# EAGLE design Encoder (EAGLE 6.2)
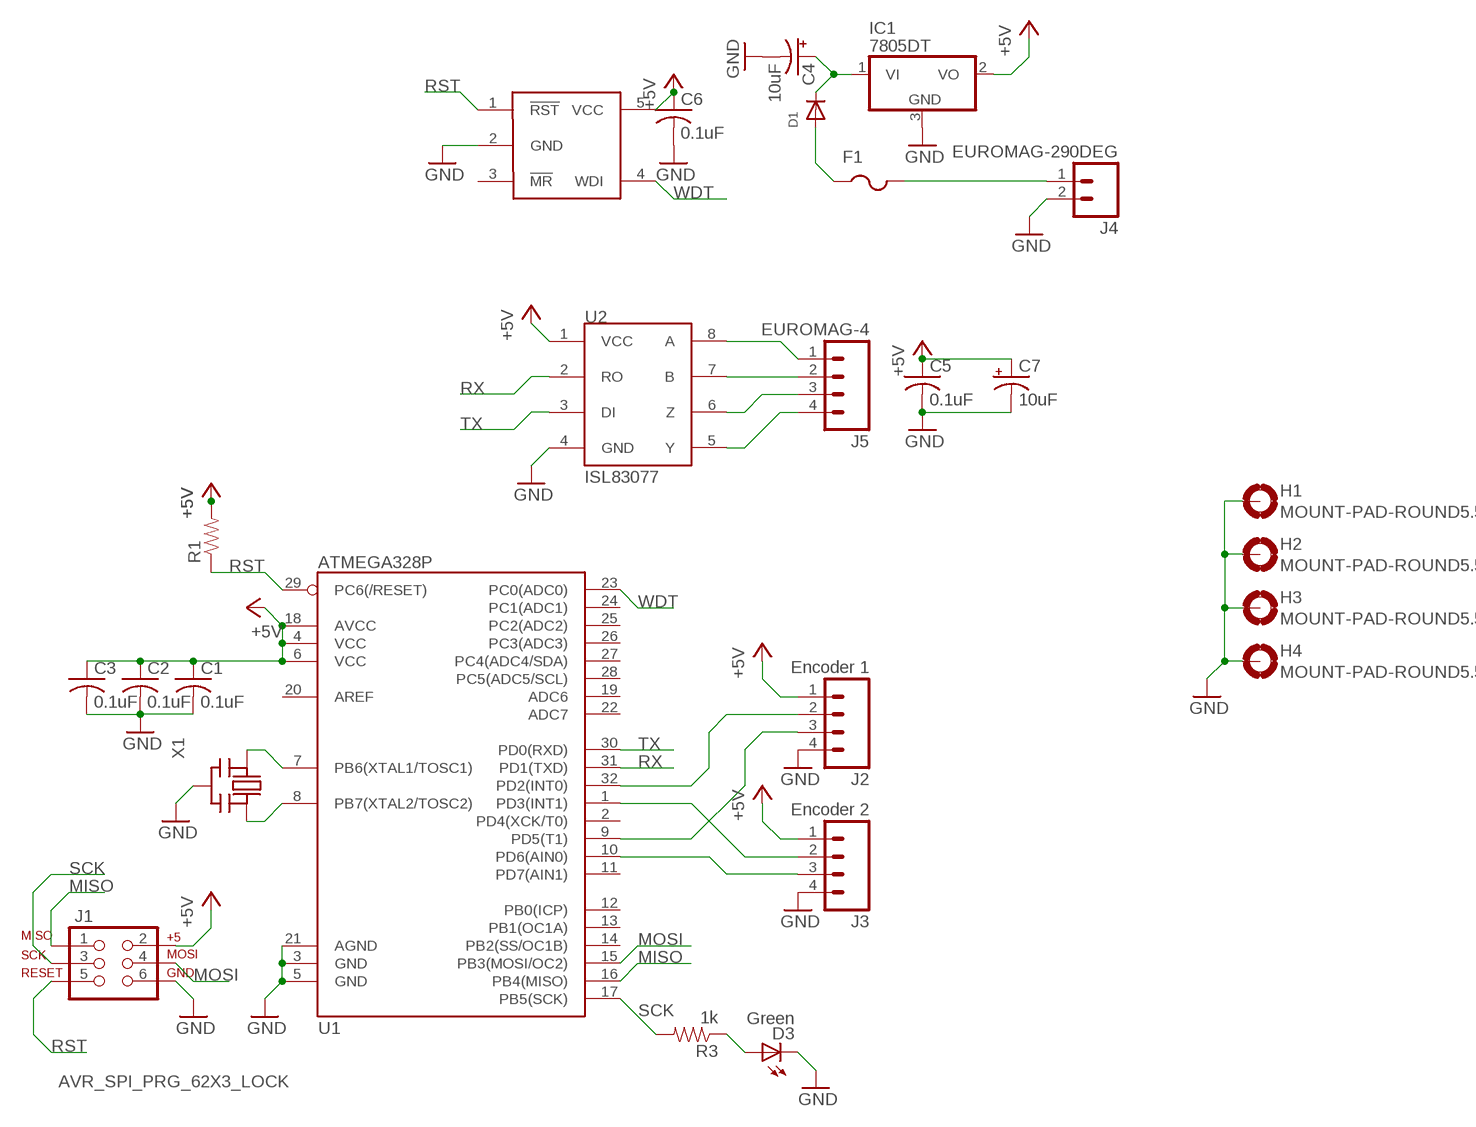
[diagram p0: schematic, sheet 1]

## Parts
C1  0.1uF  C-USC0805  [C0805]
C2  0.1uF  C-USC0805  [C0805]
C3  0.1uF  C-USC0805  [C0805]
C4  10uF  CPOL-USCT6032  [CT6032]
C5  0.1uF  C-USC0805  [C0805]
C6  0.1uF  C-USC0805  [C0805]
C7  10uF  CPOL-USCT6032  [CT6032]
D1  DIODESMA  [SMADIODE]
D3  Green  LED0603  [LED-0603]
F1  PTCFUSE-1206  [R1206]
H1  MOUNT-PAD-ROUND5.5  [5,5-PAD]
H2  MOUNT-PAD-ROUND5.5  [5,5-PAD]
H3  MOUNT-PAD-ROUND5.5  [5,5-PAD]
H4  MOUNT-PAD-ROUND5.5  [5,5-PAD]
IC1  7805DT  [TO252]
J1  AVR_SPI_PRG_62X3_LOCK  [2X3_LOCK]
J2  Encoder 1  EUROMAG-4  [M4]
J3  Encoder 2  EUROMAG-4  [M4]
J4  EUROMAG-290DEG  [M2]
J5  EUROMAG-4  [M4]
R1  RESISTOR0805-RES  [0805]
R3  1k  RESISTOR0805-RES  [0805]
U1  ATMEGA328P  ATMEGA328_SMT  [TQFP32-08]
U2  ISL83077  [SO08]
U$18  MAX823  [SOT23-5L]
X1  CERMOSCILL-AWCSR  [AWCSR]

## Nets
+5V: C1.1 C2.1 C3.1 C5.1 C6.1 C7.+ IC1.2(VO) J1.2 J2.1 J3.1 R1.2 U1.4(VCC) U1.6(VCC) U1.18(AVCC) U2.1(VCC) U$18.5(VCC)
GND: C1.2 C2.2 C3.2 C4.- C5.2 C6.2 C7.- D3.C H1.B5,5(MOUNT) H2.B5,5(MOUNT) H3.B5,5(MOUNT) H4.B5,5(MOUNT) IC1.3(GND) J1.6 J2.4 J3.4 J4.2 U1.3(GND) U1.5(GND) U1.21(AGND) U2.4(GND) U$18.2(GND) X1.2(GND)
MISO: J1.1 U1.16(PB4(MISO))
MOSI: J1.4 U1.15(PB3(MOSI/OC2))
N$1: J2.2 U1.32(PD2(INT0))
N$2: J3.2 U1.1(PD3(INT1))
N$3: J3.3 U1.10(PD6(AIN0))
N$4: J2.3 U1.9(PD5(T1))
N$6: J5.1 U2.8(A)
N$7: J5.2 U2.7(B)
N$8: J5.3 U2.6(Z)
N$9: J5.4 U2.5(Y)
N$10: F1.2 J4.1
N$11: U1.7(PB6(XTAL1/TOSC1)) X1.1(IN)
N$13: D1.A F1.1
N$14: U1.8(PB7(XTAL2/TOSC2)) X1.3(OUT)
N$15: C4.+ D1.C IC1.1(VI)
N$17: D3.A R3.1
RST: J1.5 R1.1 U1.29(PC6(/RESET)) U$18.1(!RST)
RX: U1.31(PD1(TXD)) U2.2(RO)
SCK: J1.3 R3.2 U1.17(PB5(SCK))
TX: U1.30(PD0(RXD)) U2.3(DI)
WDT: U1.23(PC0(ADC0)) U$18.4(WDI)
Unconnected: U1.2(PD4(XCK/T0)) U1.11(PD7(AIN1)) U1.12(PB0(ICP)) U1.13(PB1(OC1A)) U1.14(PB2(SS/OC1B)) U1.19(ADC6) U1.20(AREF) U1.22(ADC7) U1.24(PC1(ADC1)) U1.25(PC2(ADC2)) U1.26(PC3(ADC3)) U1.27(PC4(ADC4/SDA)) U1.28(PC5(ADC5/SCL)) U$18.3(!MR)

## Library data of the parts
C1-C3 C5 C6 = adafruit:C-US: CAPACITOR, American symbol
C4 C7 = adafruit:CPOL-US: POLARIZED CAPACITOR, American symbol
D1 = adafruit:DIODE: Diode SMADIODE - SMA Surface Mount Package 20V 1A Schottky Diode Digikey: 641-1014-6-ND DO-1N4148 - Through Hole Small Current Diode SOD-123 20V 1 A (.5mV Vf) Schottky Diode - Digikey: MBRX120TPMSCT-ND SOD-323 10V 570mA (.38mV Vf, 3ns) Schottky Diode - Digikey: ZLLS410CT-ND SOD-523 30V 30mA Schottky Diode (RB751S-40TE61) - Digikey: RB751S-40TE61CT-ND SOT23-R/W - SOT23 Package (R = Solder Paste/Reflow Ovens, W = Hand-Soldering) BAT54Film 40V 300mA - Digikey: 497-7162-1-ND
D3 = SparkFun:LED: LEDs Standard schematic elements and footprints for 5mm, 3mm, 1206, and 0603 sized LEDs. 5mm - Spark Fun Electronics SKU : COM-00529 (and others)
F1 = adafruit:PTCFUSE: PTC fuses, resettable thermistors
H1-H4 = holes:MOUNT-PAD-ROUND: MOUNTING PAD, round
IC1 = adafruit:78*: Positive VOLTAGE REGULATOR Added bigger pads to the TO-92 package
J1 = SparkFun:AVR_SPI_PRG_6: AVR ISP 6 Pin This is the reduced ISP connector for AVR programming. Common on Arduino. This footprint will take up less PCB space and can be used with a 10-pin to 6-pin adapter such as SKU: BOB-08508
J2 J3 J5 = NASA_LIB:EUROMAG-4
J4 = NASA_LIB:EUROMAG-2
R1 R3 = SparkFun-Resistors:RESISTOR: Resistor Basic schematic elements and footprints for 0603, 1206, and PTH resistors.
U1 = SparkFun-DigitalIC:ATMEGA328_SMT: 32-Pin Atmega328 part Commonly used on Arduino compatible boards Available in QFP and QFN packages TQFP is IC-09069 QFN is non-stock; PROD_ID: IC-09069
U2 = NASA_LIB:ISL83077
U$18 = NASA_LIB:MAX823
X1 = adafruit:CERMOSCILL: Ceramic oscillator with built in capacitors such as ZTT-12MHz http://www.ladyada.net/library/eagle

## Board
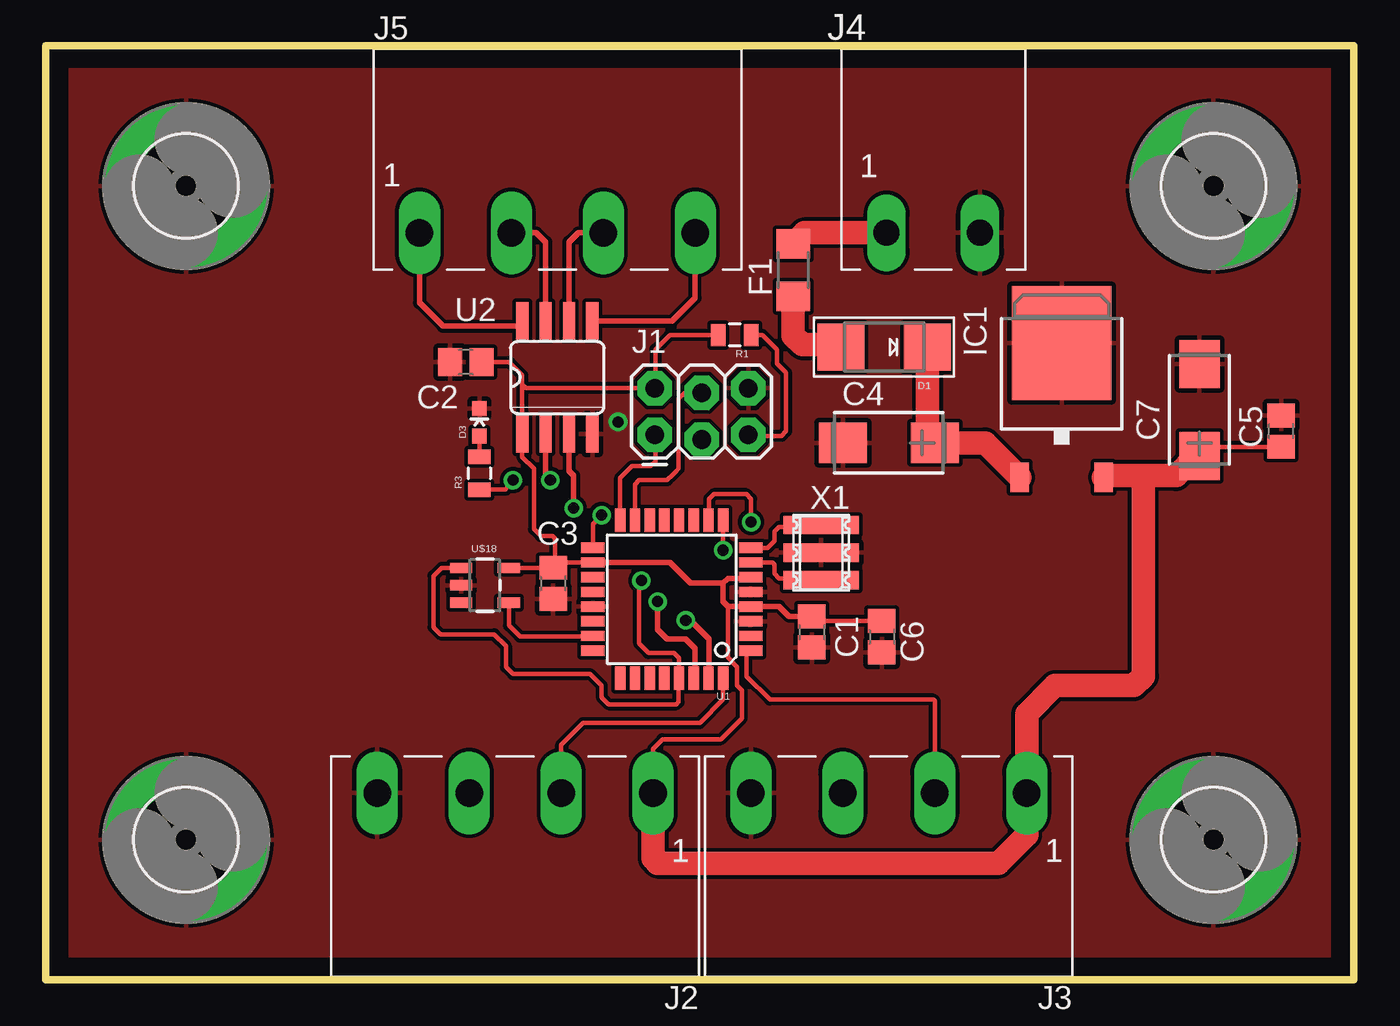
[diagram p1: board, top side]
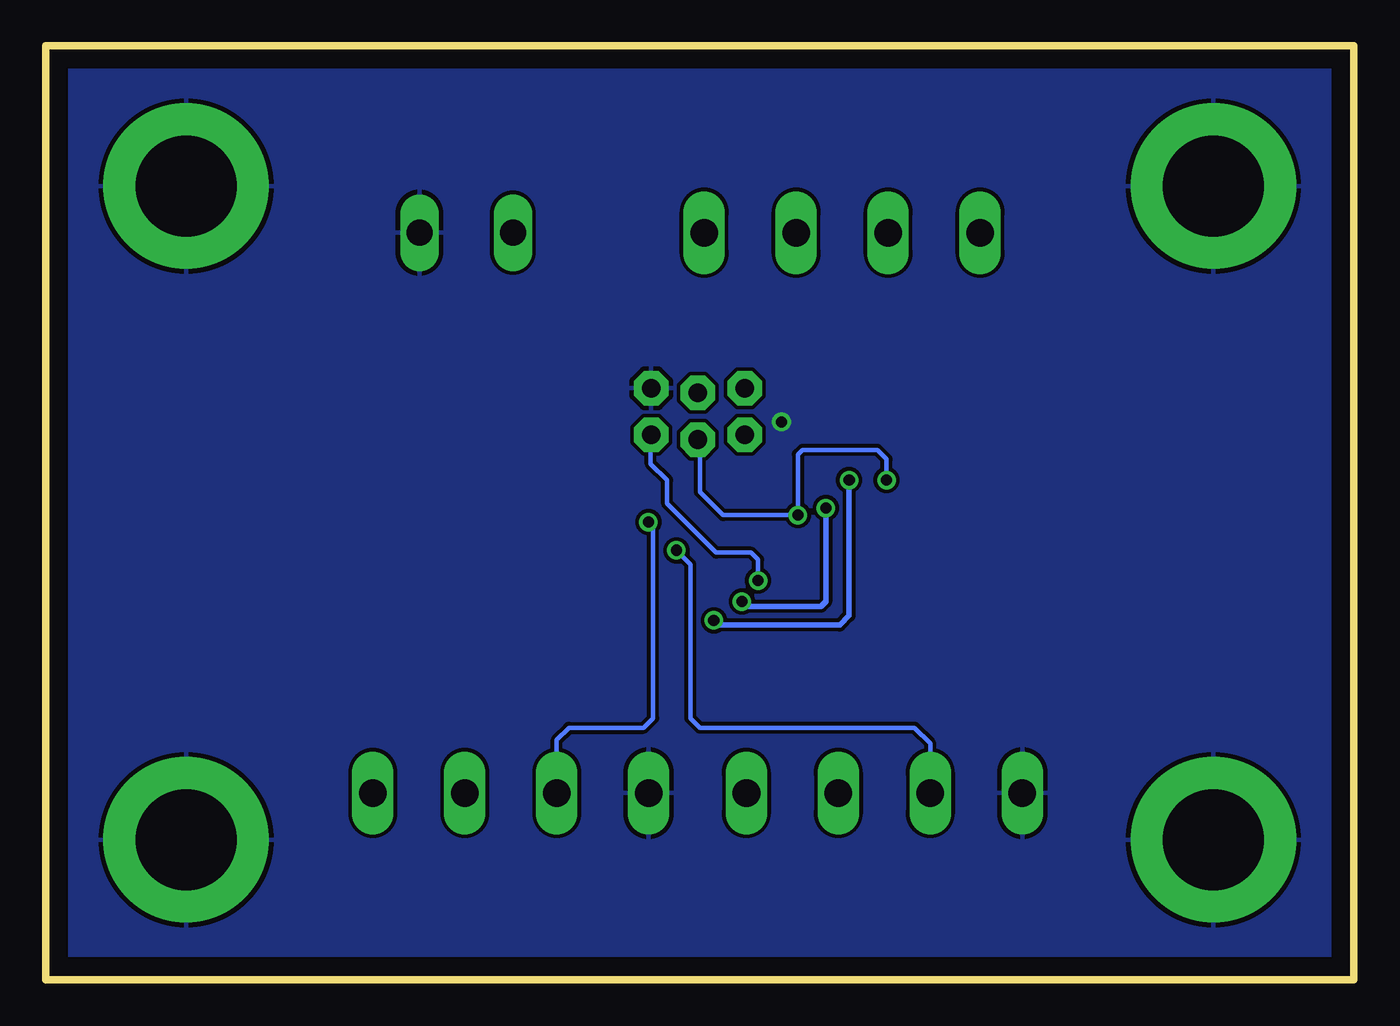
[diagram p2: board, bottom side, seen from below]

Size 71.12 x 50.8 mm. Coordinates in mm from the lower left corner, seen from the top.
Outline: 70.31,0 arc45 70.33,0.02
Outline: 0,0 71.12,0 71.12,50.8 0,50.8 0,0
Copper layers (1*16): Top 0.035mm / dielectric 1.5mm / Bottom 0.035mm
Design rules: minimum track width 10mil, minimum drill 24mil, track to track 8mil, track to pad 8mil, pad to pad 8mil, via to via 8mil, smd to smd 8mil, copper to edge 40mil, drill to drill 8mil, minimum pad ring 10mil, minimum via ring 8mil, stop-mask expansion 4mil, vias tented up to drill 0mil, thermal gap 10mil

### Footprints (pad centres in the part's own frame; a part is rotated, then mirrored left to right if it is on the bottom)
C0805 = smd 1.3 x 1.5: 1 -0.85,0; 2 0.85,0
CT6032 = smd 2.6 x 2.2: + 2.5,0; - -2.5,0
SMADIODE = smd 2.54 x 2.54: A 2.349,0; C -2.349,0
LED-0603 = smd 0.8 x 0.8: A 0,-0.75; C 0,0.75
R1206 = smd 1.6 x 1.803: 1 -1.422,0; 2 1.422,0
5,5-PAD = drill 5.5 pad 9: B5,5 0,0
TO252 = smd 1 x 1.6: 1 -2.28,-4.8; 2 2.28,-4.8 | smd 5.4 x 6.2: 3 0,2.5
2X3_LOCK = drill 1.016 pad 1.88 octagon: 1 0,0; 2 0,2.54; 3 2.54,-0.254; 4 2.54,2.286; 5 5.08,0; 6 5.08,2.54
M4 = drill 1.5 long: 1 0,0; 2 5,0; 3 10,0; 4 15,0
M2 = drill 1.4 long: 1 -2.54,0; 2 2.54,0
0805 = smd 0.8 x 1.2: 1 -0.9,0; 2 0.9,0
TQFP32-08 = smd 1.27 x 0.559: 1 -4.293,2.8; 2 -4.293,2; 3 -4.293,1.2; 4 -4.293,0.4; 5 -4.293,-0.4; 6 -4.293,-1.2; 7 -4.293,-2; 8 -4.293,-2.8; 17 4.293,-2.8; 18 4.293,-2; 19 4.293,-1.2; 20 4.293,-0.4; 21 4.293,0.4; 22 4.293,1.2; 23 4.293,2; 24 4.293,2.8 | smd 0.559 x 1.27: 9 -2.8,-4.293; 10 -2,-4.293; 11 -1.2,-4.293; 12 -0.4,-4.293; 13 0.4,-4.293; 14 1.2,-4.293; 15 2,-4.293; 16 2.8,-4.293; 25 2.8,4.293; 26 2,4.293; 27 1.2,4.293; 28 0.4,4.293; 29 -0.4,4.293; 30 -1.2,4.293; 31 -2,4.293; 32 -2.8,4.293
SO08 = smd 0.66 x 2.032: 1 -1.905,-3.073; 2 -0.635,-3.073; 3 0.635,-3.073; 4 1.905,-3.073; 5 1.905,3.073; 6 0.635,3.073; 7 -0.635,3.073; 8 -1.905,3.073
SOT23-5L = smd 0.55 x 1.2: 1 -0.95,-1.3; 2 0,-1.3; 3 0.95,-1.3; 4 0.95,1.3; 5 -0.95,1.3
AWCSR = smd 1 x 4.1: 1 -1.5,0; 2 0,0; 3 1.5,0

### Placement (x,y rotation side)
C1  41.66,18.92 270 top
C2  22.83,33.6 180 top
C3  27.58,21.56 270 top
C4  45.85,29.21 0 top
C5  67.18,29.84 90 top
C6  45.47,18.67 270 top
C7  62.74,30.99 270 top
D1  45.59,34.42 180 top
D3  23.57,30.33 0 top
F1  40.64,38.61 90 top
H1  7.62,7.62 0 top
H2  63.5,7.62 0 top
H3  7.62,43.18 0 top
H4  63.5,43.18 0 top
IC1  55.24,32.13 0 top
J1  33.12,29.64 0 top
J2  33.02,10.16 180 top
J3  53.34,10.16 180 top
J4  48.26,40.64 0 top
J5  20.32,40.64 0 top
R1  37.47,35.08 180 top
R3  23.57,27.56 270 top
U1  34.04,20.7 180 top
U2  27.81,32.77 0 top
U$18  23.88,21.46 270 top
X1  42.16,23.24 90 top

### Tracks (layer width: path | path; a pad name or v marks a point on that pad's centre or on a via)
+5V
  Top 0.254: R1.2 33.93,35.08 33.15,34.29 33.15,32.21 J1.2 26.11,32.18 25.91,32.38 | U1.18 27.87,22.7 C3.1 | U$18.5 C3.1 | C2.1 25.2,33.6 25.91,32.89 25.91,32.38 | 25.91,32.38 U2.1 25.91,28.45 26.54,27.81 26.54,24.51 26.92,24.13 27.56,24.13 27.69,24 27.69,22.52 C3.1 | J2.1 33.02,12.57 33.53,13.08 36.7,13.08 37.85,14.22 37.85,15.75 37.59,16 37.59,17.02 37.08,17.53 37.08,20.32 36.89,20.51 | C6.1 41.91,19.52 C1.1 | C5.1 62.9,29 62.48,28.57 62.65,28.57 C7.+
  Top 0.305: C1.1 40.42,19.77 39.88,20.32 38.35,20.32 U1.4 37.1,20.3 36.89,20.51 36.83,20.57 36.83,21.59 | 36.83,21.59 37.08,21.84 38.27,21.84 U1.6 | U1.18 33.94,22.7 35.05,21.59 36.83,21.59
  Top 1.27: 59.69,27.43 59.69,16.51 59.18,16 54.86,16 53.34,14.48 J3.1 53.34,7.87 51.82,6.35 33.27,6.35 33.02,6.6 J2.1 | 59.69,27.43 57.63,27.43 IC1.2 | C7.+ 62.52,28.49 61.47,27.43 59.69,27.43
GND  (via drill 0.6)
  other vias: 31.11,30.35
  pour Top: 0,0 71.12,0 71.12,50.8 0,50.8
  pour Bottom: 0,0 71.12,0 71.12,50.8 0,50.8
MISO
  Top 0.254: U1.16 31.24,27.3 31.88,27.94 32.89,27.94 33.15,28.19 33.15,29.62 J1.1
MOSI
  Top 0.254: U1.15 32.04,26.96 32.26,27.18 33.78,27.18 34.1,27.5 34.29,27.69 34.42,27.81 34.42,31.62 34.72,31.93 J1.4
N$1
  Top 0.254: J2.2 28.02,12.78 29.21,13.97 35.56,13.97 36.83,15.24 U1.32 | 36.83,16.51 U1.32 | U1.32
N$2
  Top 0.254: J3.2 48.34,15.16 48.26,15.24 39.37,15.24 38.1,16.51 38.1,17.67 U1.1
N$3  (via drill 0.6)
  Top 0.254: v38.35,24.89 38.35,26.16 38.1,26.42 36.32,26.42 36.07,26.16 36.07,25.03 U1.10
  Bottom 0.254: J3.3 43.34,13.05 42.67,13.72 38.61,13.72 38.1,14.22 38.1,24.64 v38.35,24.89
N$4  (via drill 0.6)
  Top 0.254: v36.83,23.37 U1.9
  Bottom 0.254: J2.3 23.02,12.86 23.88,13.72 35.56,13.72 36.07,14.22 36.07,22.61 v36.83,23.37
N$6
  Top 0.305: J5.1 20.32,36.83 21.59,35.56 25.63,35.56 U2.8
N$7
  Top 0.305: J5.2 26.67,40.64 27.18,40.13 U2.7
N$8
  Top 0.305: U2.6 28.45,40.13 28.96,40.64 J5.3
N$9
  Top 0.305: U2.5 34.06,35.84 35.31,37.08 35.31,40.63 J5.4
N$10
  Top 1.27: J4.1 41.25,40.64 F1.2
N$11
  Top 0.254: U1.7 39.53,22.7 39.62,22.61 39.62,22.1 39.88,21.84 42.06,21.84 X1.1
N$13
  Top 1.27: F1.1 40.64,35.05 41.15,34.54 43.12,34.54 D1.A
N$14
  Top 0.254: U1.8 39.25,23.5 39.62,23.88 39.62,24.38 39.88,24.64 42.06,24.64 X1.3
N$15
  Top 1.27: D1.C 47.94,29.61 C4.+ 51.09,29.21 IC1.1
N$17
  Top 0.254: R3.1 D3.A
RST  (via drill 0.6)
  Top 0.254: R1.1 38.96,35.08 39.75,34.29 39.75,33.53 40.26,33.02 40.26,29.84 40.01,29.59 38.25,29.59 J1.5 | v32.38,21.72 32.26,21.59 32.26,18.29 32.77,17.78 34.16,17.78 34.44,17.51 U1.29 34.42,16.39 34.42,15.11 34.29,14.99 30.61,14.99 30.23,15.37 30.23,16 29.59,16.64 25.4,16.64 25.02,17.02 25.02,18.16 24.38,18.8 21.46,18.8 21.08,19.18 21.08,21.97 21.52,22.41 U$18.1
  Bottom 0.254: v32.38,21.72 32.38,22.86 32.77,23.24 34.67,23.24 37.34,25.91 37.34,27.18 38.23,28.07 38.23,29.62 J1.5
RX  (via drill 0.6)
  Top 0.305: U2.2 27.18,27.43 v27.43,27.18 | v34.8,19.56 35.05,19.56 36.07,18.54 36.07,16.44 U1.31
  Bottom 0.305: v27.43,27.18 27.43,19.81 27.94,19.3 34.54,19.3 v34.8,19.56
SCK  (via drill 0.6)
  Top 0.254: U1.17 29.74,24.79 v30.23,25.27 | R3.2 25.01,26.66 v25.4,27.18
  Bottom 0.254: v30.23,25.27 30.48,25.27 | 30.48,25.27 34.29,25.27 35.56,26.54 35.56,29.29 J1.3 | v25.4,27.18 25.4,28.32 25.91,28.83 29.97,28.83 30.23,28.57 30.23,25.53 30.48,25.27
TX  (via drill 0.6)
  Top 0.305: U2.3 28.45,27.69 28.7,27.43 v28.7,25.65 | v33.27,20.57 33.27,19.05 33.78,18.54 34.8,18.54 35.31,18.03 35.31,16.48 U1.30
  Bottom 0.305: v28.7,25.65 28.7,20.57 28.96,20.32 33.02,20.32 v33.27,20.57
WDT
  Top 0.254: U$18.4 25.18,19.27 25.78,18.67 29.71,18.67 U1.23